# Altium schematic sheet Input.SchDoc
size A4; SheetNumber: 2; SheetTotal: 3
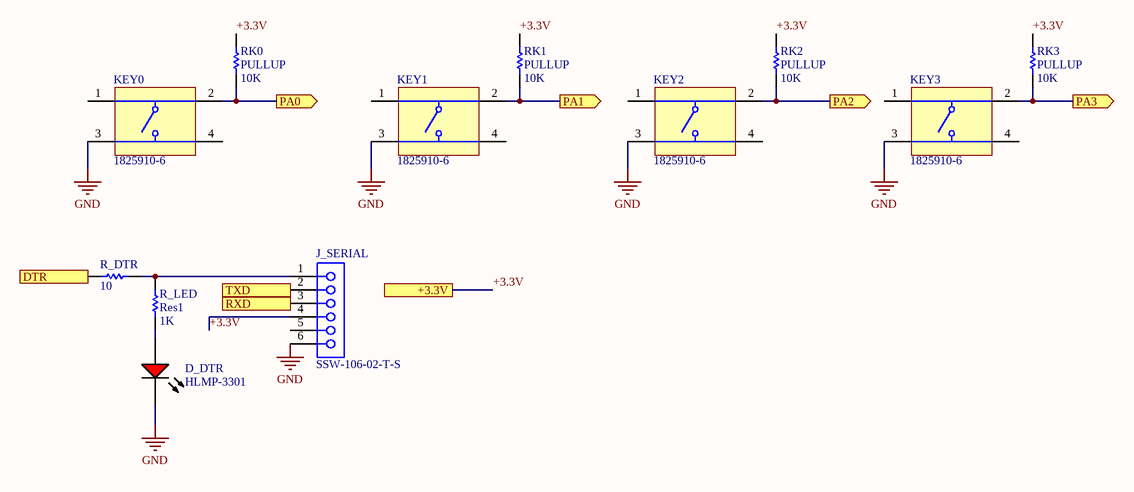
[diagram p0: Input.SchDoc]

## Parts
D_DTR  HLMP-3301  [AVAG-HLMP-3301-2]
J_SERIAL  SSW-106-02-T-S  [SMTC-SSW-106-02-X-S]
KEY0  1825910-6  [TECO-1825910-6_V]
KEY1  1825910-6  [TECO-1825910-6_V]
KEY2  1825910-6  [TECO-1825910-6_V]
KEY3  1825910-6  [TECO-1825910-6_V]
R_DTR  10  [AXIAL-0.1-RES]
R_LED  Res1  value 1K  [AXIAL-0.1-RES]
RK0  PULLUP  value 10K  [AXIAL-0.1-RES]
RK1  PULLUP  value 10K  [AXIAL-0.1-RES]
RK2  PULLUP  value 10K  [AXIAL-0.1-RES]
RK3  PULLUP  value 10K  [AXIAL-0.1-RES]

## Ports
+3.3V, DTR (out), PA0 (out), PA1 (out), PA2 (out), PA3 (out), RXD (in), TXD (out)

## Nets
GND: D_DTR.1(K) J_SERIAL.6 KEY0.3 KEY1.3 KEY2.3 KEY3.3
+3.3V: J_SERIAL.4 RK0.2 RK1.2 RK2.2 RK3.2 ; port +3.3V
DTR: R_DTR.1 ; port DTR
PA0: KEY0.2 RK0.1 ; port PA0
PA1: KEY1.2 RK1.1 ; port PA1
PA2: KEY2.2 RK2.1 ; port PA2
PA3: KEY3.2 RK3.1 ; port PA3
RXD: J_SERIAL.3 ; port RXD
TXD: J_SERIAL.2 ; port TXD
NetD_DTR_2: D_DTR.2(A) R_LED.1
NetJ_SERIAL_1: J_SERIAL.1 R_DTR.2 R_LED.2

Not connected (* = marked no-connect by the designer): J_SERIAL 5; KEY0 1 4; KEY1 1 4; KEY2 1 4; KEY3 1 4

## Library data of the parts
D_DTR = CMP-2000-06411-1: T-1 3/4 (5 mm) Diffused LED Lamp, 1.9 V, -40 to 100 degC, 2-Pin THD, RoHS, Bulk; Manufacturer: Avago; Forward Current: 25mA; Forward Voltage: 2.4V; Peak Wavelength: 635nm; Shape Type: Circular; High Brightness: No; Main Category: StandardLED; Test Current (It): 10mA; Dominant Wave Length: 626nm; Number of  Elements: 1; Reverse Voltage: 5V; Chip Material: GaP; Product Height (mm): 9.19mm; Lens Type: ColoredDiffused; Viewing Angle: 60deg; Emitting Color: Red; Luminous Intensity: 5.4mcd; Power Dissipation: 85W; DELETED: Compliant; Product Depth (mm): 6.1mm; Package Description: 2-Pin Through Hole LED, Dia 5.85 mm; Mounting Technology: ThroughHole; Manufacturer URL: http://www.avagotech.com/; Package Type: T-13/4; Operating Temp Range: -40Cto100C; Datasheet URL: http://www.avagotech.com/docs/AV02-1558EN; Mounting: ThroughHole; Lens Dimensions: 5.08x5.08x8.3mm; Package Reference: HLMP-3301; Datasheet Version: 03/2015; Pin Count: 2; Packaging: TapeandReel; Type: Uni-Color; Operating Temperature Classification: Industrial; Lum Intensity: 5.4mcd; Rad Hardened: No; Product Length (mm): 6.1mm
J_SERIAL = CMP-1023-00360-1: SQ Post Socket, Through-hole, Vertical, -55 to 105 degC, 2.54mm Pitch, 6-Pin, Female, RoHS; Manufacturer: Samtec; ComponentLink1URL: http://www.samtec.com; Temperature Range: -55 to 105 degC; Pitch: 2.54 mm; Mounting Technology: Through-hole; DatasheetVersion: F-214; ComponentLink1Description: Manufacturer URL; PackageVersion: CA, 6/1987; ComponentLink3Description: Package Specification; PackageDescription: Assembly, Socket Strip .016 X .031 Tail; ComponentLink2Description: Datasheet; ComponentLink2URL: http://www.samtec.com/documents/webfiles/pdf/SSW_TH.PDF; PackageReference: SSW-106-02-X-S; ComponentLink3URL: http://www.samtec.com/documents/webfiles/cpdf/SSW-1XX-XX-XXX-X-XX-XXX-XX-MKT.pdf; RoHS: True; PartNumber: SSW-106-02-T-S; Orientation: Vertical
KEY0-KEY3 = CMP-1684-00021-1: Tact Switch, SPST-NO, 0.05 A, -35 to 85 degC, 4-Pin THD, RoHS, Bulk; Manufacturer: TE Connectivity; Maximum Contact Resistance: 100mOhm; Mechanical Life: 100000Cycles; Bushing Type: Unthreaded; Switch Configuration: OFF(ON); Maximum DC Voltage Rating: 24V; Contact Rating @ Voltage: 0.05A@24VDC; Actuator Color: Black; Body Orientation: Straight; Function: MomentaryContact; Illumination: N/R; Actuator Style: RoundButton; Actuator Material: PolybutyleneTerephthalate; Dielectric Strength: 500VAC; Pole Throw Configuration: SPST; Actuator Length: 1.4mm; Product Weight: N/A; Contact Material: CopperAlloy; Housing Material: N/A; Terminal Type: PCPins; Minimum Insulation Resistance: 100MOhm; Package Description: 4-Pin Through Hole Device, Body 5.99 x 5.99 mm, Pitch 6.5 mm; Part No: 1825910-6; Package Reference: THD; Base Material: N/A; Manufacturer URL: http://www.te.com; Contact Plating: Silver; RoHS: Yes; Datasheet Version: Rev. C9; Electrical Life: 100000Cycles; Maximum AC Voltage Rating: N/A; Thread Size: N/R; Operating Temperature: -35to85C; Mounting: ThroughHole; Dimension: 5.99x5mm; Datasheet URL: http://www.te.com/commerce/DocumentDelivery/DDEController?Action=showdoc&DocId=Customer+Drawing%7F1825910%7FC9%7Fpdf%7FEnglish%7FENG_CD_1825910_C9.pdf%7F1825910-6; Family: 1825910; Seal Location: N/A; Seal Description: N/A; Packaging: N/A
R_DTR = RES 10 OHM 5% 1/4W AXIAL: Resistor; Manufacturer Part Number: CFR-25JB-52-10R; Designator: R?; Power Rating: 1/4W; Tolerance: 0.05; Published: 8-Jun-2000; LatestRevisionDate: 17-Jul-2002; LatestRevisionNote: Re-released for DXP Platform.; Publisher: Altium Limited
R_LED = RES 1K OHM 5% 1/4W AXIAL: Resistor; Manufacturer Part Number: CFR-25JB-52-1K; Designator: R?; Power Rating: 1/4W; Tolerance: 0.05; Published: 8-Jun-2000; LatestRevisionDate: 17-Jul-2002; LatestRevisionNote: Re-released for DXP Platform.; Publisher: Altium Limited
RK0-RK3 = RES 10K OHM 5% 1/4W AXIAL: Resistor; Manufacturer Part Number: CFR-25JB-52-10K; Designator: R?; Power Rating: 1/4W; Tolerance: 0.05; Published: 8-Jun-2000; LatestRevisionDate: 17-Jul-2002; LatestRevisionNote: Re-released for DXP Platform.; Publisher: Altium Limited